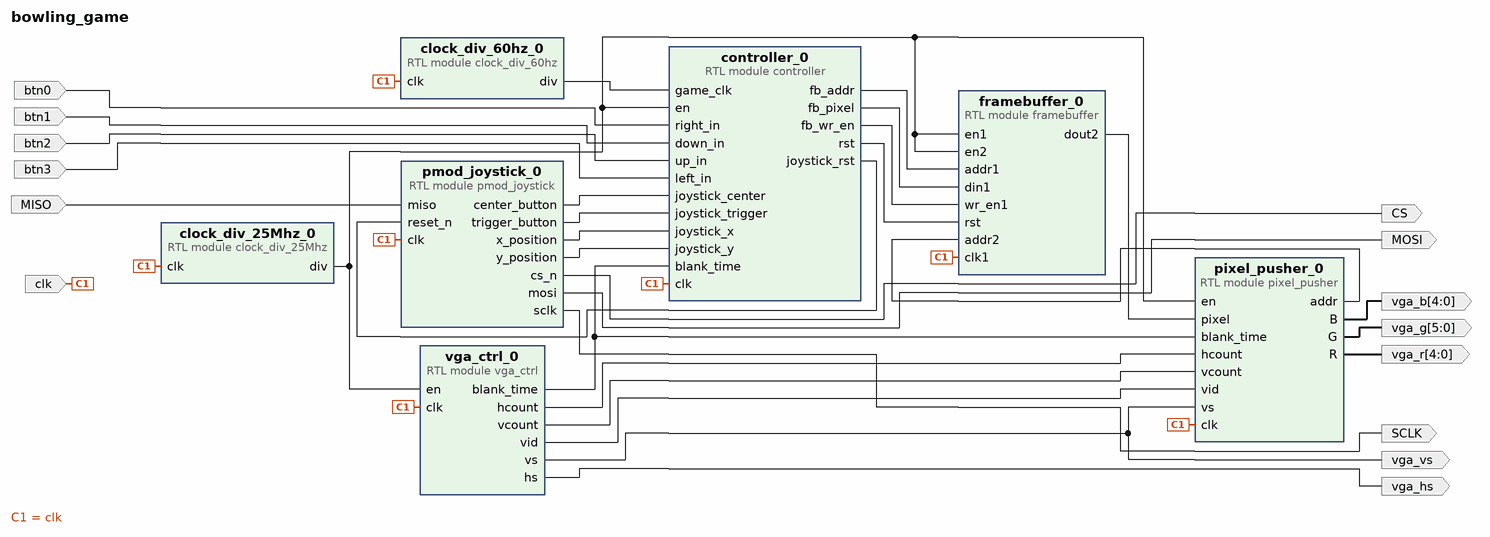
[diagram p0: block diagram of the top level]
# Vivado block design bowling_game, xc7z010clg400-1, Vivado 2021.1
create_bd_design bowling_game

create_bd_port -dir I clk
create_bd_port -dir O -from 4 -to 0 vga_r
create_bd_port -dir O -from 4 -to 0 vga_b
create_bd_port -dir O -from 5 -to 0 vga_g
create_bd_port -dir O vga_hs
create_bd_port -dir O vga_vs
create_bd_port -dir I btn0
create_bd_port -dir I btn3
create_bd_port -dir I btn1
create_bd_port -dir I btn2
create_bd_port -dir I MISO
create_bd_port -dir O SCLK
create_bd_port -dir O CS
create_bd_port -dir O MOSI

create_bd_cell -type module -reference clock_div_25Mhz clock_div_25Mhz_0
create_bd_cell -type module -reference pixel_pusher pixel_pusher_0
create_bd_cell -type module -reference framebuffer framebuffer_0
create_bd_cell -type module -reference vga_ctrl vga_ctrl_0
create_bd_cell -type module -reference clock_div_60hz clock_div_60hz_0
create_bd_cell -type module -reference pmod_joystick pmod_joystick_0
create_bd_cell -type module -reference controller controller_0

# ---- connections ----

connect_bd_net [get_bd_ports MISO] [get_bd_pins pmod_joystick_0/miso]
connect_bd_net -net btn0_1 [get_bd_ports btn0] [get_bd_pins controller_0/right_in]
connect_bd_net -net btn1_1 [get_bd_ports btn1] [get_bd_pins controller_0/down_in]
connect_bd_net -net btn2_1 [get_bd_ports btn2] [get_bd_pins controller_0/up_in]
connect_bd_net -net btn3_1 [get_bd_ports btn3] [get_bd_pins controller_0/left_in]
connect_bd_net [get_bd_ports clk] \
  [get_bd_pins clock_div_25Mhz_0/clk] [get_bd_pins pixel_pusher_0/clk] [get_bd_pins framebuffer_0/clk1] \
  [get_bd_pins vga_ctrl_0/clk] [get_bd_pins clock_div_60hz_0/clk] [get_bd_pins pmod_joystick_0/clk] \
  [get_bd_pins controller_0/clk]
connect_bd_net [get_bd_pins clock_div_25Mhz_0/div] \
  [get_bd_pins pixel_pusher_0/en] [get_bd_pins framebuffer_0/en1] [get_bd_pins framebuffer_0/en2] [get_bd_pins vga_ctrl_0/en] \
  [get_bd_pins controller_0/en]
connect_bd_net [get_bd_pins clock_div_60hz_0/div] [get_bd_pins controller_0/game_clk]
connect_bd_net [get_bd_pins controller_0/fb_addr] [get_bd_pins framebuffer_0/addr1]
connect_bd_net [get_bd_pins controller_0/fb_pixel] [get_bd_pins framebuffer_0/din1]
connect_bd_net [get_bd_pins controller_0/fb_wr_en] [get_bd_pins framebuffer_0/wr_en1]
connect_bd_net [get_bd_pins controller_0/joystick_rst] [get_bd_pins pmod_joystick_0/reset_n]
connect_bd_net [get_bd_pins controller_0/rst] [get_bd_pins framebuffer_0/rst]
connect_bd_net [get_bd_pins framebuffer_0/dout2] [get_bd_pins pixel_pusher_0/pixel]
connect_bd_net [get_bd_pins pixel_pusher_0/B] [get_bd_ports vga_b]
connect_bd_net [get_bd_pins pixel_pusher_0/G] [get_bd_ports vga_g]
connect_bd_net [get_bd_pins pixel_pusher_0/R] [get_bd_ports vga_r]
connect_bd_net [get_bd_pins pixel_pusher_0/addr] [get_bd_pins framebuffer_0/addr2]
connect_bd_net [get_bd_pins pmod_joystick_0/center_button] [get_bd_pins controller_0/joystick_center]
connect_bd_net [get_bd_pins pmod_joystick_0/cs_n] [get_bd_ports CS]
connect_bd_net [get_bd_pins pmod_joystick_0/mosi] [get_bd_ports MOSI]
connect_bd_net [get_bd_pins pmod_joystick_0/sclk] [get_bd_ports SCLK]
connect_bd_net [get_bd_pins pmod_joystick_0/trigger_button] [get_bd_pins controller_0/joystick_trigger]
connect_bd_net [get_bd_pins pmod_joystick_0/x_position] [get_bd_pins controller_0/joystick_x]
connect_bd_net [get_bd_pins pmod_joystick_0/y_position] [get_bd_pins controller_0/joystick_y]
connect_bd_net [get_bd_pins vga_ctrl_0/blank_time] [get_bd_pins pixel_pusher_0/blank_time] [get_bd_pins controller_0/blank_time]
connect_bd_net [get_bd_pins vga_ctrl_0/hcount] [get_bd_pins pixel_pusher_0/hcount]
connect_bd_net [get_bd_pins vga_ctrl_0/hs] [get_bd_ports vga_hs]
connect_bd_net [get_bd_pins vga_ctrl_0/vcount] [get_bd_pins pixel_pusher_0/vcount]
connect_bd_net [get_bd_pins vga_ctrl_0/vid] [get_bd_pins pixel_pusher_0/vid]
connect_bd_net [get_bd_pins vga_ctrl_0/vs] [get_bd_ports vga_vs] [get_bd_pins pixel_pusher_0/vs]

validate_bd_design
save_bd_design
